# EAGLE design Thermostat (EAGLE 9.6.2)
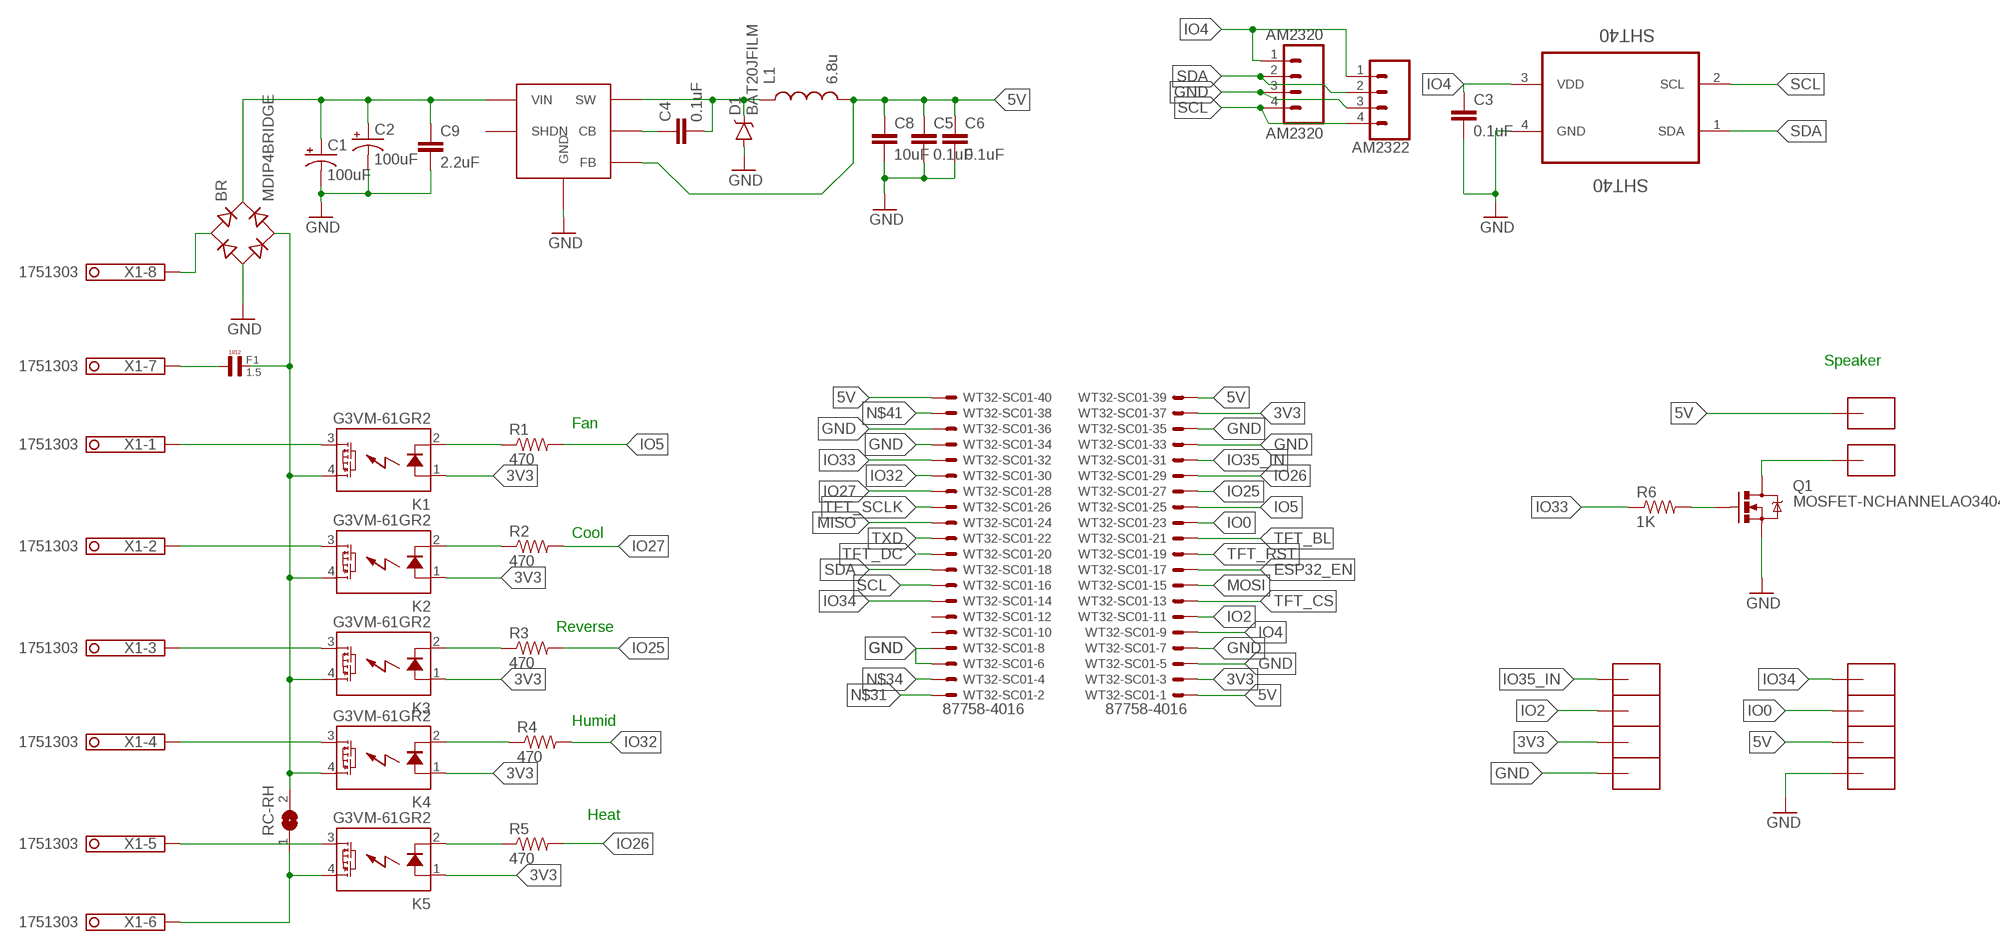
[diagram p0: schematic, sheet 1]

## Parts
AM2320  AM2320  M04PTH  [1X04]
AM2322  CONN_041.27MM  [1X04_1.27MM]
BR  MDIP4BRIDGE  [MICRODIP4]
C1  100uF  CAP_POLC  [PANASONIC_C]
C2  100uF  CAP_POLC  [PANASONIC_C]
C3  0.1uF  CAP0805  [0805]
C4  0.1uF  CAP0805  [0805]
C5  0.1uF  CAP0805  [0805]
C6  0.1uF  CAP0805  [0805]
C8  10uF  CAP0805  [0805]
C9  2.2uF  CAP0805  [0805]
D1  BAT20JFILM  [SOD-323]
F1  1.5  0,1µF  [L4,8]
K1  G3VM-61GR2  AQY22SOP  [SOP04]
K2  G3VM-61GR2  AQY22SOP  [SOP04]
K3  G3VM-61GR2  AQY22SOP  [SOP04]
K4  G3VM-61GR2  AQY22SOP  [SOP04]
K5  G3VM-61GR2  AQY22SOP  [SOP04]
L1  6.8u  INDUCTOR1007  [1007]
Q1  MOSFET-NCHANNELAO3404A  [SOT23-3]
R1  470  RESISTOR0805-RES  [0805]
R2  470  RESISTOR0805-RES  [0805]
R3  470  RESISTOR0805-RES  [0805]
R4  470  RESISTOR0805-RES  [0805]
R5  470  RESISTOR0805-RES  [0805]
R6  1K  RESISTOR0805-RES  [0805]
RC-RH  SJ  [SJ]
SHT40  SHT40  [SHT40]
U$1  SMD-PAD1SMD-PAD80X32  [SMD-PAD6]
U$2  SMD-PAD1SMD-PAD80X32  [SMD-PAD6]
U$3  SMD-PAD1SMD-PAD80X32  [SMD-PAD6]
U$4  SMD-PAD1SMD-PAD80X32  [SMD-PAD6]
U$5  SMD-PAD1SMD-PAD80X32  [SMD-PAD6]
U$6  SMD-PAD1SMD-PAD80X32  [SMD-PAD6]
U$7  SMD-PAD1SMD-PAD80X32  [SMD-PAD6]
U$9  SMD-PAD1SMD-PAD80X32  [SMD-PAD6]
U$10  SMD-PAD1SMD-PAD80X32  [SMD-PAD6]
U$11  SMD-PAD1SMD-PAD80X32  [SMD-PAD6]
VREG  LMR16006YQ  [SOT-23-6]
WT32-SC01  87758-4016  [87758-4016]
X1  1751303  [1751303]

## Nets
3V3: K1.1(A) K2.1(A) K3.1(A) K4.1(A) K5.1(A) U$1.>PAD WT32-SC01.3 WT32-SC01.37
5V: C5.1 C6.1 C8.1 L1.2 U$5.>PAD U$7.>PAD VREG.3(FB) WT32-SC01.1 WT32-SC01.39 WT32-SC01.40
ESP32_EN: WT32-SC01.17
GND: AM2320.3 AM2322.3 BR.- C1.- C2.- C3.2 C5.2 C6.2 C8.2 C9.2 D1.A Q1.2(S) SHT40.4(GND) U$2.>PAD U$9.>PAD VREG.2(GND) WT32-SC01.5 WT32-SC01.6 WT32-SC01.7 WT32-SC01.8 WT32-SC01.33 WT32-SC01.34 WT32-SC01.35 WT32-SC01.36
IO0: U$10.>PAD WT32-SC01.23
IO2: U$3.>PAD WT32-SC01.11
IO4: AM2320.1 AM2322.1 C3.1 SHT40.3(VDD) WT32-SC01.9
IO5: R1.2 WT32-SC01.25
IO25: R3.2 WT32-SC01.27
IO26: R5.2 WT32-SC01.29
IO27: R2.2 WT32-SC01.28
IO32: R4.2 WT32-SC01.30
IO33: R6.1 WT32-SC01.32
IO34: U$6.>PAD WT32-SC01.14
IO35_IN: U$4.>PAD WT32-SC01.31
MISO: WT32-SC01.24
MOSI: WT32-SC01.15
N$2: C4.2 D1.C L1.1 VREG.6(SW)
N$3: BR.AC2 F1.P$2 K1.4(DS1) K2.4(DS1) K3.4(DS1) K4.4(DS1) RC-RH.2
N$4: K4.2(K) R4.1
N$6: Q1.1(G) R6.2
N$7: K3.2(K) R3.1
N$10: K2.2(K) R2.1
N$11: K4.3(DS2) X1.4
N$13: K2.3(DS2) X1.2
N$15: K1.3(DS2) X1.1
N$16: K1.2(K) R1.1
N$17: C4.1 VREG.1(CB)
N$18: K5.3(DS2) X1.5
N$20: BR.AC1 X1.8
N$22: K5.4(DS1) RC-RH.1 X1.6
N$23: F1.P$1 X1.7
N$24: BR.+ C1.+ C2.+ C9.1 VREG.5(VIN)
N$25: K5.2(K) R5.1
N$29: K3.3(DS2) X1.3
N$31: WT32-SC01.2
N$34: WT32-SC01.4
N$39: Q1.3(D) U$11.>PAD
N$41: WT32-SC01.38
SCL: AM2320.4 AM2322.4 SHT40.2(SCL) WT32-SC01.16
SDA: AM2320.2 AM2322.2 SHT40.1(SDA) WT32-SC01.18
TFT_BL: WT32-SC01.21
TFT_CS: WT32-SC01.13
TFT_DC: WT32-SC01.20
TFT_RST: WT32-SC01.19
TFT_SCLK: WT32-SC01.26
TXD: WT32-SC01.22
Unconnected: VREG.4(SHDN) WT32-SC01.10 WT32-SC01.12

## Notes on the sheet
- Speaker
- Fan
- Cool
- Reverse
- Humid
- Heat

## Library data of the parts
AM2320 = SparkFun-Connectors:M04: Header 4 Standard 4-pin 0.1" header. Use with straight break away headers (SKU : PRT-00116), right angle break away headers (PRT-00553), swiss pins (PRT-00743), machine pins (PRT-00117), and female headers (PRT-00115). Molex polarized connector foot print use with SKU : PRT-08231 with associated crimp pins and housings. 1MM SMD Version SKU: PRT-10208; PROD_ID: CONN-09696
AM2322 = SparkFun-Connectors:CONN_04: Multi connection point. Often used as Generic Header-pin footprint for 0.1 inch spaced/style header connections On any of the 0.1 inch spaced packages, you can populate with these: Break Away Headers - Straight <https://www.sparkfun.com/products/116> (PRT-00116) Break Away Male Headers - Right Angle <https://www.sparkfun.com/products/553> (PRT-00553) Female Headers <https://www.sparkfun.com/products/115> (PRT-00115) Break Away Headers - Machine Pin <https://www.sparkfun.com/products/117> (PRT-00117) Break Away Female Headers - Swiss Machine Pin <https://www.sparkfun.com/products/743> (PRT-00743) For SCREWTERMINALS and SPRING TERMINALS visit here: Screw Terimnals on SparkFun.com <https://www.sparkfun.com/search/results?term=Screw+Terminals> (5mm/3.5mm/2.54mm spacing) This device is also useful as a general connection point to wire up your design to another part of your project. Our various solder wires solder well into these plated through hole pads. Hook-Up Wire - Assortment (Stranded, 22 AWG) <https://www.sparkfun.com/products/11375> (PRT-11375) Hook-Up Wire - Assortment (Solid Core, 22 AWG) <https://www.sparkfun.com/products/11367> (PRT-11367) View the entire wire category on our website here <https://www.sparkfun.com/categories/141> Special notes: Molex polarized connector foot print use with SKU : PRT-08231 with associated crimp pins and housings. 1MM SMD Version SKU: PRT-10208
BR = CuriousTech:MDIP4BRIDGE
C1 C2 = SparkFun-Capacitors:CAP_POL: Capacitor Polarized These are standard SMD and PTH capacitors. Normally 10uF, 47uF, and 100uF in electrolytic and tantalum varieties. Always verify the external diameter of the through hole cap, it varies with capacity, voltage, and manufacturer. The EIA devices should be standard.
C3-C6 C8 C9 = SparkFun-Capacitors:CAP: Capacitor Standard 0603 ceramic capacitor, and 0.1" leaded capacitor.
D1 = SparkFun-DiscreteSemi:BAT20JFILM: 23V, 1A Schottky diode, SOD-323 package; PROD_ID: DIO-11623
F1 = Capacitor-Wima-SMD1812-100v:0,1µF
K1-K5 = relay:AQY*: PhotoMOS Relay NAiS Source: http://www.panasonic-electric-works.com/catalogues/downloads/photomos/ds_x615_en_aqz10_20.pdf; OC_FARNELL: unknown; OC_NEWARK: unknown
L1 = SparkFun-Passives:INDUCTOR: Inductors Basic Inductor/Choke - 0603 and 1206. Footprints are not proven and vary greatly between part numbers. INDUCTOR POWER 3.3UH 4.0A SMD 0.197" L x 0.197" W x 0.177" H (5.00mm x 5.00mm x 4.50mm)
Q1 = SparkFun-DiscreteSemi:MOSFET-NCHANNEL: Common NMOSFET Parts MFG P/N Store ID Prod ID FDD8780 TRANS-09984 SI7820DN TRANS-11055 FDS6630A IC-08089 2N7002PW TRANS-11151 FQP30N06L COM-10213 TRANS-10060 BSS123LT1G TRANS-08345 BSS138 TRANS-00830 BS170 2N7000; PROD_ID: TRAN-12988
R1-R5 = SparkFun-Passives:RESISTOR: Resistor Basic schematic elements and footprints for 0603, 1206, and PTH resistors.
R6 = SparkFun-Resistors:RESISTOR: Resistor Basic schematic elements and footprints for 0603, 1206, and PTH resistors.
RC-RH = jumper:SJ: SMD solder JUMPER
SHT40 = CuriousTech:SHT40
U$1-U$7 U$9-U$11 = CuriousTech:SMD-PAD1: SMD-PAD small
VREG = CuriousTech:LMR16006YQ
WT32-SC01 = con-molex:87758-4016: 40 Pin - 2mm Dual Row Single Wafer, Vertical T/H HDR Source: http://www.molex.com/pdm_docs/sd/877580616_sd.pdf; MF: MOLEX; MPN: 87758-4016; OC_FARNELL: unknown; OC_NEWARK: 25M5691
X1 = con-phoenix-350:1751303: MKDS 1/ 8-3,5 Printklemme Nennstrom: 10 A Bemessungsspannung: 160 V Raster: 3,5 mm Polzahl: 8 Montageart: Löten Anschlussart: Schraubanschluss Anschlussrichtung vom Leiter zur Platine: 0° Source: http://eshop.phoenixcontact.com .. .pdf; OC_FARNELL: unknown; OC_NEWARK: unknown

## Board
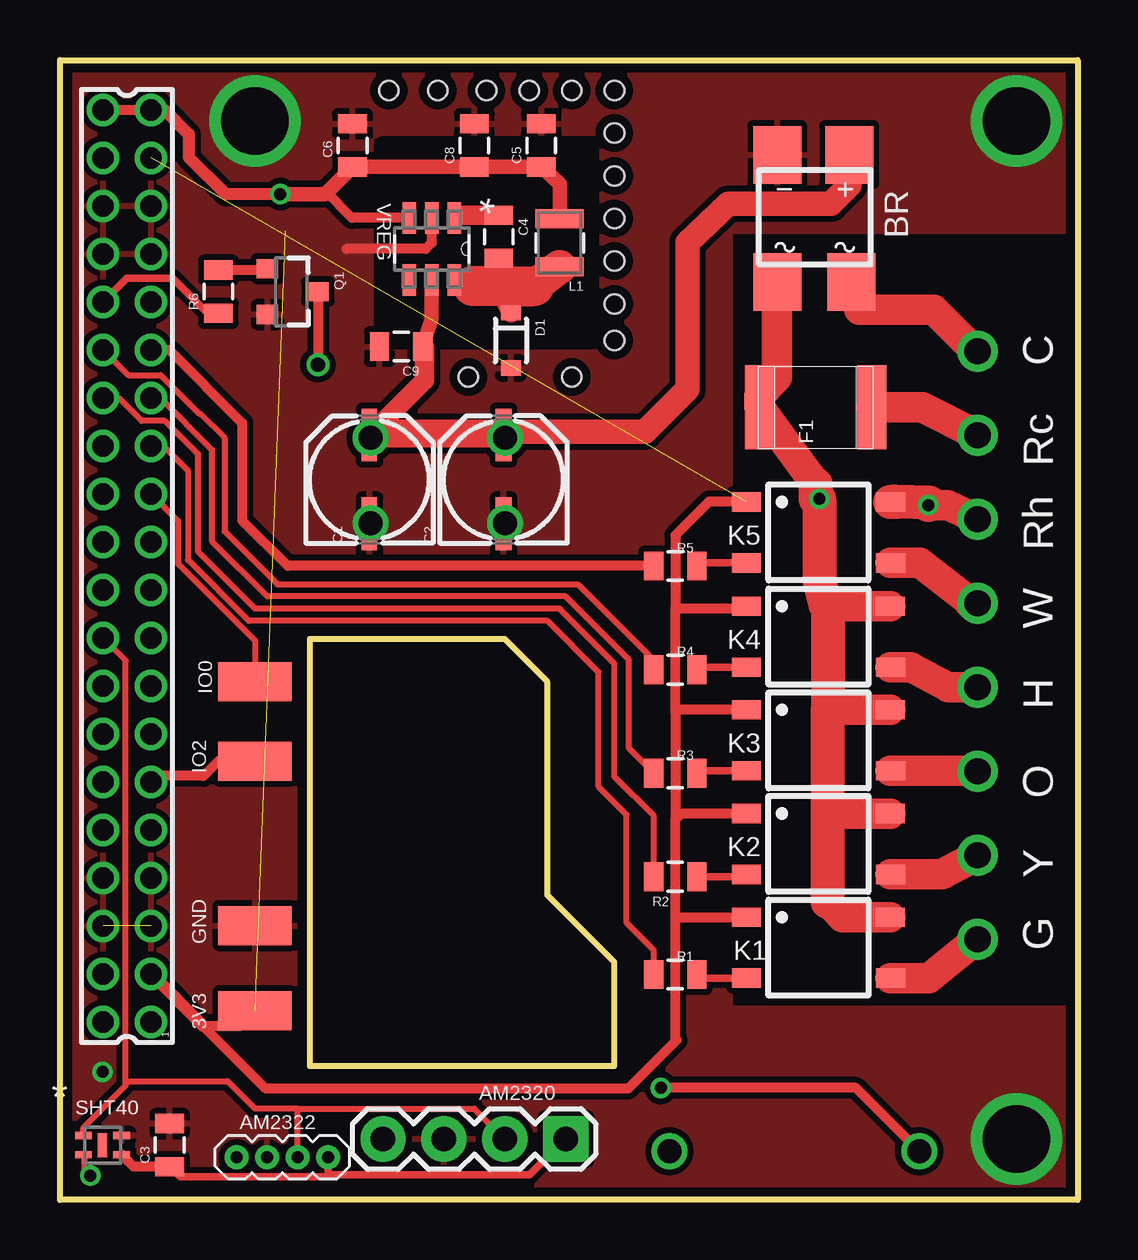
[diagram p1: board, top side]
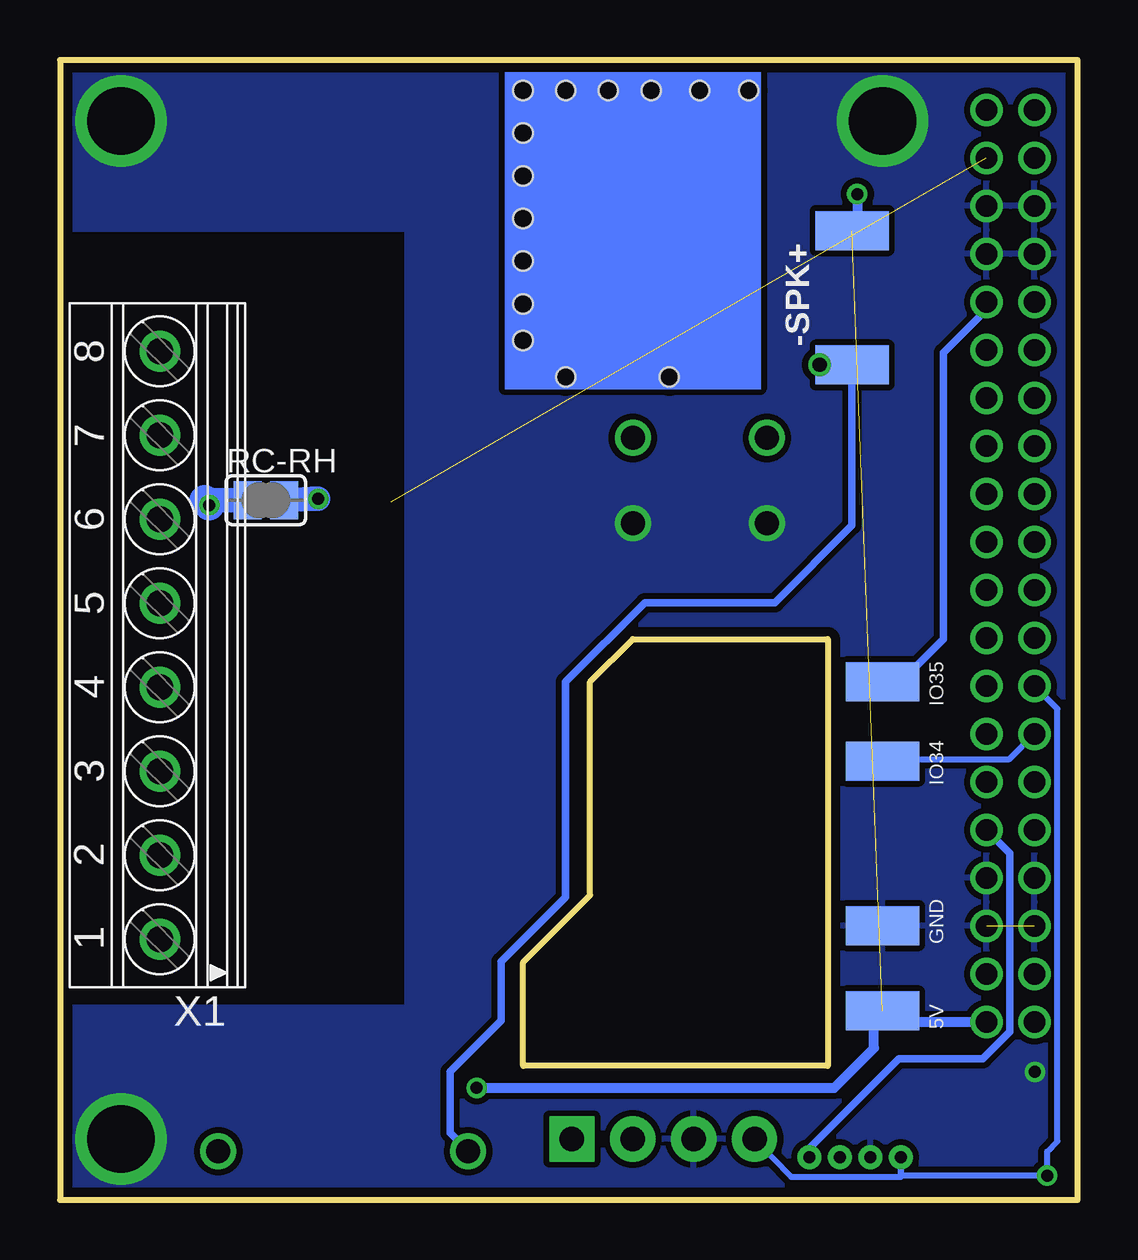
[diagram p2: board, bottom side, seen from below]

Size 42.42 x 47.5 mm. Coordinates in mm from the lower left corner, seen from the top.
Outline: 42.42,0 0,0 0,47.5 42.42,47.5 42.42,0
Outline: 10.41,23.37 10.41,5.59 23.11,5.59 23.11,9.91 20.32,12.7 20.32,21.59 18.54,23.37 10.41,23.37
Copper layers (1*16): Top 0.0356mm / dielectric 1.5011mm / Bottom 0.0356mm
Design rules "LaenPCBOrder": minimum track width 6mil, minimum drill 13mil, track to track 6mil, track to pad 6mil, pad to pad 6mil, via to via 6mil, smd to smd 6mil, copper to edge 15mil, drill to drill 6mil, minimum pad ring 7mil, minimum via ring 7mil, stop-mask expansion 4mil, vias tented up to drill 0mil, thermal gap 10mil
Holes 0.8 mm at 17.78,46.23 19.56,46.23 21.34,46.23 23.11,46.23 23.11,44.45 23.11,42.67 23.11,40.89 23.11,39.12 23.11,37.34 23.11,35.81 21.34,34.29 17.02,34.29 15.75,46.23 13.72,46.23
tRestrict: area 13.5,35.8 to 22.1,43.9

### Footprints (pad centres in the part's own frame; a part is rotated, then mirrored left to right if it is on the bottom)
1X04 = drill 1.016 pad 1.88 square: 1 0,0 | drill 1.016 pad 1.88: 2 2.54,0; 3 5.08,0; 4 7.62,0
1X04_1.27MM = drill 0.508 pad 1: 1 0,0; 2 1.27,0; 3 2.54,0; 4 3.81,0
MICRODIP4 = smd 2 x 2.4: + -1.4,-2.65; - 1.6,-2.65; AC1 -1.5,2.65; AC2 1.6,2.65
PANASONIC_C = smd 2.2 x 0.65: + 1.9,-0.2; - -1.8,-0.2
0805 = smd 0.8 x 1.2: 1 -0.9,0; 2 0.9,0
SOD-323 = smd 0.63 x 0.83: A 1.15,0; C -1.15,0
L4,8 = smd 3.5 x 1.2: P$1 0,-2.35; P$2 0,2.35
SOP04 = smd 0.8 x 1.2: 1 -1.27,-3; 2 1.27,-3; 3 1.27,3; 4 -1.27,3
1007 = smd 2 x 0.8: 1 0,1; 2 0,-1
SOT23-3 = smd 0.8 x 0.9: 1 -0.95,-1; 2 0.95,-1; 3 0,1.1
SJ = smd 1.168 x 1.6: 1 -0.762,0; 2 0.762,0
SHT40 = smd 0.7 x 0.3: 1 -0.8,0.4; 2 -0.8,-0.4; 3 0.8,-0.4; 4 0.8,0.4 | smd 0.4 x 1: P$1 0,0
SMD-PAD6 = smd 3.048 x 1.626: >PAD 0,0
SOT-23-6 = smd 1.321 x 0.559: 1 -1.295,0.94; 2 -1.295,0; 3 -1.295,-0.94; 4 1.295,-0.94; 5 1.295,0; 6 1.295,0.94
87758-4016 = drill 0.9 pad 1.27: 1 -19,-1; 2 -19,1; 3 -17,-1; 4 -17,1; 5 -15,-1; 6 -15,1; 7 -13,-1; 8 -13,1; 9 -11,-1; 10 -11,1; 11 -9,-1; 12 -9,1; 13 -7,-1; 14 -7,1; 15 -5,-1; 16 -5,1; 17 -3,-1; 18 -3,1; 19 -1,-1; 20 -1,1; 21 1,-1; 22 1,1; 23 3,-1; 24 3,1; 25 5,-1; 26 5,1; 27 7,-1; 28 7,1; 29 9,-1; 30 9,1; 31 11,-1; 32 11,1; 33 13,-1; 34 13,1; 35 15,-1; 36 15,1; 37 17,-1; 38 17,1; 39 19,-1; 40 19,1
1751303 = drill 1.1 pad 1.7: 1 -12.25,-0.1; 2 -8.75,-0.1; 3 -5.25,-0.1; 4 -1.75,-0.1; 5 1.75,-0.1; 6 5.25,-0.1; 7 8.75,-0.1; 8 12.25,-0.1

### Placement (x,y rotation side)
AM2320  21.08,2.54 180 top
AM2322  11.18,1.78 180 top
BR  31.5,40.89 180 top
C1  12.7,29.97 90 top
C2  18.29,29.97 90 top
C3  4.57,2.29 90 top
C4  18.29,40.13 270 top
C5  20.07,43.94 90 top
C6  12.19,43.94 90 top
C8  17.27,43.94 90 top
C9  14.22,35.56 180 top
D1  18.8,35.81 270 top
F1  31.5,33.02 90 top
K1  31.61,10.51 270 top
K2  31.61,14.83 270 top
K3  31.61,19.15 270 top
K4  31.61,23.47 270 top
K5  31.61,27.81 270 top
L1  20.83,39.88 180 top
Q1  9.65,37.85 270 top
R1  25.65,9.4 180 top
R2  25.65,13.46 180 top
R3  25.65,17.78 180 top
R4  25.65,22.1 180 top
R5  25.65,26.42 180 top
R6  6.6,37.85 90 top
RC-RH  33.84,29.16 0 bottom
SHT40  1.78,2.29 0 top
U$1  8.13,7.87 0 top
U$2  8.13,11.43 0 bottom
U$3  8.13,18.29 0 top
U$4  8.13,21.59 0 bottom
U$5  9.4,40.39 0 bottom
U$6  8.13,18.29 0 bottom
U$7  8.13,7.87 0 bottom
U$9  8.13,11.43 0 top
U$10  8.13,21.59 0 top
U$11  9.4,34.8 180 bottom
VREG  15.49,39.62 270 top
WT32-SC01  2.79,26.42 90 top
X1  38.35,23.11 90 bottom

### Tracks (layer width: path | path; a pad name or v marks a point on that pad's centre or on a via)
3V3  (1 unrouted)
  Top 0.305: 25.65,11.68 25.71,11.74 25.71,11.78
  Top 0.406: 25.71,11.78 K1.1 | 25.65,15.88 25.65,11.68 25.65,6.67 25.71,6.67 23.68,4.64 21.08,4.64 8.57,4.64 5.97,7.24 7.49,7.24 U$1.>PAD | 25.65,15.88 25.95,16.1 K2.1 | 25.65,20.32 25.65,15.88 | K4.1 28.51,24.64 25.65,24.64 | K5.1 28.6,29.09 27.06,29.09 25.65,27.69 25.65,24.64 | K3.1 25.75,20.42 25.65,20.32 | 25.65,20.32 25.65,24.64
  Top 0.508: WT32-SC01.3 5.97,7.24
5V  (via drill 0.5, 1)  (1 unrouted)
  Top 0.305: C6.1 12.13,43.04 11.08,42
  Top 0.406: C5.1 | C5.1 20.08,43.05 | C5.1 | WT32-SC01.40 WT32-SC01.39 | L1.2 | VREG.3 12.16,40.92 | 12.16,40.91 12.16,40.92 | 12.16,40.92 11.08,42 | v35.81,2.03 33.17,4.67 v25.04,4.67 | C8.1
  Top 0.508: WT32-SC01.39 4.37,45.42 5.37,44.41 5.37,43.43 6.9,41.91 v9.18,41.91
  Top 0.61: L1.2 20.84,42.32 20.08,43.05 | C5.1 C8.1 C6.1 11.06,41.91 v9.18,41.91
  Bottom 0.305: 8.48,7.52 U$7.>PAD
  Bottom 0.406: 9.65,40.39 U$5.>PAD 9.18,40.6 v9.18,41.91 9.14,41.91 | U$7.>PAD 7.67,7.42 WT32-SC01.1 | v25.04,4.67 10.14,4.67 8.48,6.33 8.48,7.52
GND  (via drill 0.5, 1, 2.8)  (1 unrouted)
  Top 0.406: 15.49,40.39 VREG.2 15.49,39.88 15.24,39.62 11.94,39.62
  other vias: 12.95,28.19 8.13,44.96 39.88,44.96 39.88,2.54 18.54,28.19 1.78,5.33
  pour Top (isolate 0.254): 0,0.25 0.25,0 42.42,0 42.42,7.96 27.94,7.96 27.94,40.39 42.42,40.39 42.42,47.5 0,47.5
  pour Bottom (isolate 0.254): 42.42,40.47 27.94,40.47 27.94,8.01 42.42,8.01 42.42,0 0.2,0 0,0.19 0,47.5 42.42,47.5
IO0
  Top 0.254: WT32-SC01.23 4.93,28.28 4.93,26.5 8.13,23.3 U$10.>PAD
IO2
  Top 0.406: U$3.>PAD 6.6,18.29 5.99,17.67 4.05,17.67 WT32-SC01.11
IO4
  Top 0.305: AM2320.1 21.06,2.54 19.57,1.04 11.2,1.04 11.18,1.02 | 4.57,1.4 5,0.97 11.13,0.97 11.18,1.02 | 11.18,1.02 AM2322.1
  Top 0.406: SHT40.3 3.06,1.4 4.57,1.4 C3.1
  Bottom 0.305: WT32-SC01.9 2.81,14.44 2.81,7.01 3.94,5.88 7.45,5.88 11.18,2.15 AM2322.1
IO5
  Top 0.254: R1.2 24.75,10.41 23.62,11.55 23.62,16.05 22.45,17.22 22.45,22 20.32,24.13 7.87,24.13 5.33,26.67 5.33,30.38 4.3,31.42 WT32-SC01.25
IO25
  Top 0.254: R3.2 23.71,18.82 23.71,22.52 21.08,25.15 8.64,25.15 6.35,27.43 6.35,31.24 4.18,33.42 WT32-SC01.27
IO26
  Top 0.406: R5.2 9.49,26.42 7.6,28.3 7.6,32.37 4.56,35.42 WT32-SC01.29
IO27
  Top 0.254: R2.2 24.75,16 23.11,17.64 23.11,22.35 20.83,24.64 8.13,24.64 5.76,27 5.76,31.07 4.37,32.46 3.4,32.46 2.44,33.42 WT32-SC01.28
IO32
  Top 0.254: WT32-SC01.30 2.84,34.37 4.19,34.37 5.79,32.77 5.84,32.77 6.86,31.75 6.86,27.86 9.06,25.65 21.59,25.65 24.75,22.49 R4.2
IO33
  Top 0.305: R6.1 6.16,36.95 4.71,38.4 2.77,38.4 WT32-SC01.32
IO34
  Bottom 0.254: U$6.>PAD 8.05,18.37 2.84,18.37 WT32-SC01.14
IO35_IN
  Bottom 0.305: U$4.>PAD 7.37,21.59 5.59,23.37 5.59,35.31 3.79,37.1 WT32-SC01.31
N$2
  Top 0.61: 17.21,38.08 17.2,38.33 VREG.6
  Top 0.813: D1.C 18.29,38.08 C4.2
  Top 1.422: 19.77,38.08 L1.1
  Top 1.676: 19.77,38.08 18.29,38.08 17.21,38.08
N$3  (via drill 0.5)
  Top 0.406: 32,24.74 31.9,24.84
  Top 1.27: K3.4 32,20.42 | K1.4 32.61,11.78 32,12.42 | K2.4 32,16.1 | K4.4 32,24.74 | 31.5,29.84 F1.P$2 29.15,33.53 29.9,34.28 BR.AC2 | BR.AC2
  Top 1.422: 32,12.42 32,16.1 32,20.42 32,24.74 | 31.5,29.84 31.5,29.21 v31.65,29.21 31.65,25.86 31.9,24.84
  Bottom 1.016: RC-RH.2 31.9,29.21 v31.65,29.21
N$4
  Top 0.305: K4.2 26.66,22.2 R4.1
N$6
  Top 0.406: Q1.1 8.86,38.59 8.55,38.93 8.18,38.75 R6.2
N$7
  Top 0.305: K3.2 26.66,17.88 R3.1
N$10
  Top 0.305: R2.1 28.51,13.46 K2.2
N$11
  Top 1.27: K4.3 35.46,22.2 37.03,21.36 X1.4
N$13
  Top 1.27: X1.2 36.76,13.56 K2.3
N$15
  Top 1.27: K1.3 36.23,9.24 38.22,10.86 X1.1
N$16
  Top 0.305: R1.1 26.68,9.4 26.84,9.24 K1.2
N$17
  Top 0.406: VREG.1 16.55,41.03
  Top 0.813: 16.55,41.03 C4.1
N$18
  Top 1.27: K5.3 35.84,26.54 37.89,24.97 37.94,24.86 X1.5
N$20
  Top 1.27: X1.8 38.16,35.36 36.43,37.09 33.32,37.09 BR.AC1
N$22  (via drill 0.5)
  Top 1.27: v36.2,28.96 37.02,28.96 X1.6
  Top 1.422: K5.4 34.87,29.08 36.28,29.04 v36.2,28.96
  Bottom 1.016: RC-RH.1 36.4,29.16
  Bottom 1.27: 36.4,29.16 v36.2,28.96
N$23
  Top 1.27: X1.7 35.94,33.02 F1.P$1
N$24  (via drill 1)
  Top 0.406: v12.95,31.75 12.95,31.82 C1.+
  Top 0.61: C9.1 15.49,36.7 VREG.5
  Top 0.813: C1.+ 15.19,34.16 15.19,35.52 15.15,35.56 C9.1
  Top 1.016: BR.+ 32.9,42.27 32.13,41.51 27.87,41.51 26.16,39.88 26.16,33.78 24.38,32 13.37,32 13.25,31.89 C1.+ C2.+ 18.54,31.82 v18.54,31.75
N$25
  Top 0.305: K5.2 26.69,26.54 R5.1
N$29
  Top 1.27: K3.3 38.25,17.88 X1.3
N$39  (via drill 0.6, 1)
  Top 0.406: Q1.3 v10.75,34.8
  Bottom 0.305: v25.4,2.03 26.16,2.79 26.16,5.33 24.03,7.47 24.03,9.93 21.34,12.62 21.34,21.59 18.03,24.89 12.62,24.89 9.4,28.11 U$11.>PAD
  Bottom 0.406: U$11.>PAD v10.75,34.8
SCL  (via drill 0.5)
  Top 0.254: SHT40.2 1.02,1.85 1.02,1.27 v1.27,1.02
  Bottom 0.254: WT32-SC01.16 0.84,20.46 0.84,2.45 1.27,2.02 v1.27,1.02 7.37,1.02 AM2322.4 7.37,0.96 11.94,0.96 AM2320.4
SDA
  Top 0.254: SHT40.1 0.98,3.01 2.75,4.78 2.75,4.95 | 2.75,4.95 2.75,22.46 WT32-SC01.18 | 2.75,4.95 6.99,4.95 8.13,3.81 9.91,3.81 | AM2320.2 18.49,2.54 17.27,3.81 9.91,3.81 | AM2322.2 9.91,3.81
(copper drawn outside any net)
  shapes: Bottom area x1

### Text on the board
tPlace: C | Rc | Rh | W | H | O | Y | G
tNames: IO0 | IO2 | GND | 3V3
bNames: -SPK+ | IO35 | IO34 | GND | 5V
bStop: CuriousTech.net | ESP32-HVAC